# Altium schematic sheet POEInjectorTop.SchDoc
size A
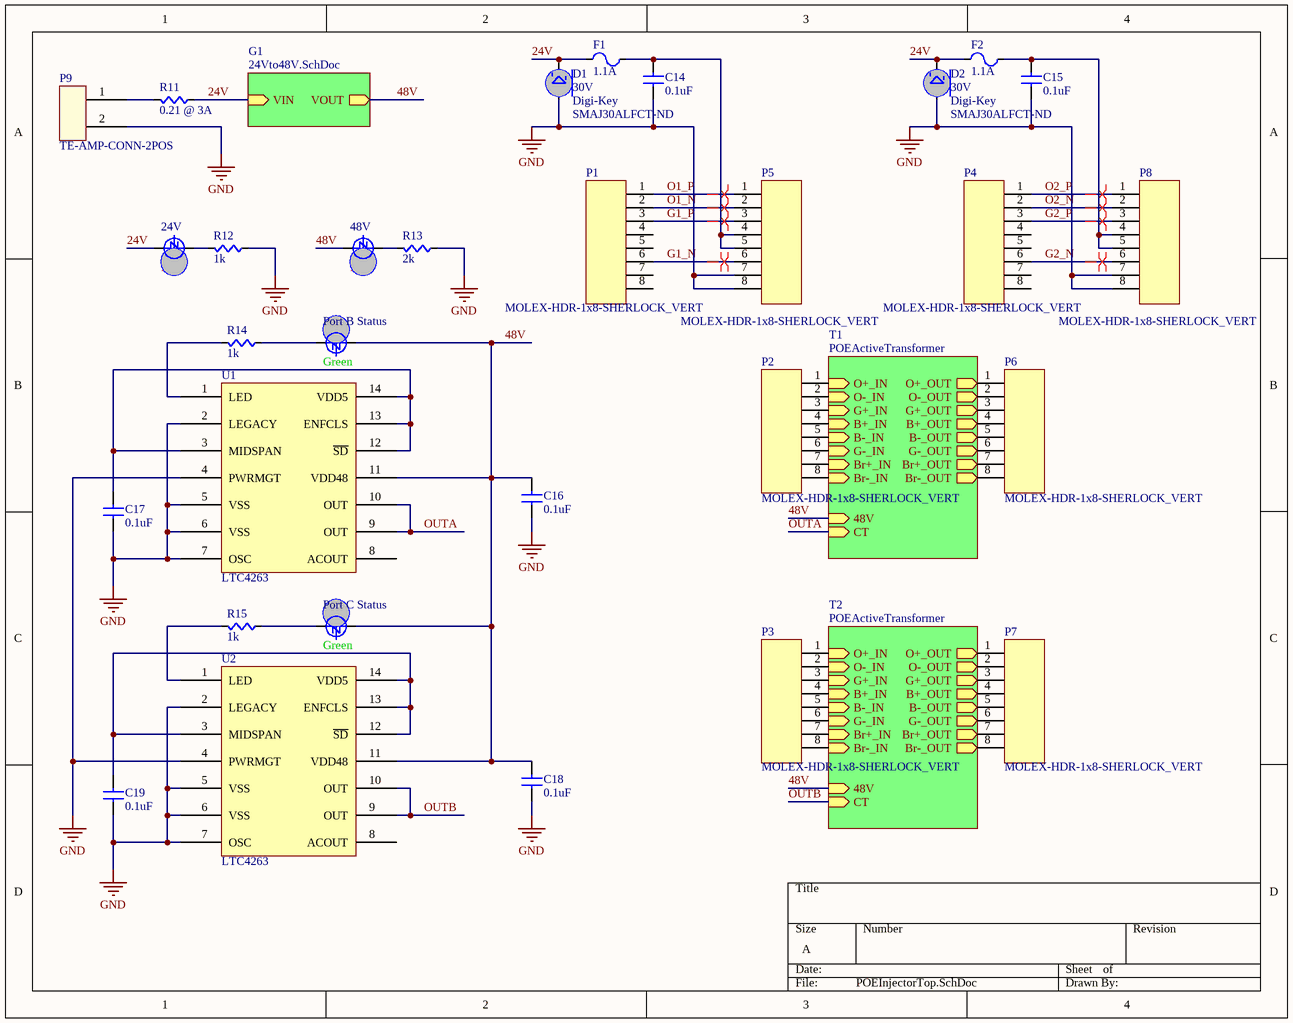
[diagram p0: POEInjectorTop.SchDoc]

## Parts
24V  Color: Red  [LED0603]  (hidden comment: LED)
48V  Color: Red  [LED0603]  (hidden comment: LED)
C14  value 0.1uF  [CAPC0603]  (hidden comment: Cap)
C15  value 0.1uF  [CAPC0603]  (hidden comment: Cap)
C16  value 0.1uF  [CAPC0603]  (hidden comment: Cap)
C17  value 0.1uF  [CAPC0603]  (hidden comment: Cap)
C18  value 0.1uF  [CAPC0603]  (hidden comment: Cap)
C19  value 0.1uF  [CAPC0603]  (hidden comment: Cap)
D1  value 30V  Supplier 1: Digi-Key  Supplier Part Number 1: SMAJ30ALFCT-ND  [SMASeries]  (hidden comment: Zener)
D2  value 30V  Supplier 1: Digi-Key  Supplier Part Number 1: SMAJ30ALFCT-ND  [SMASeries]  (hidden comment: Zener)
F1  value 1.1A  [PTC7451X11N]  (hidden comment: PTC Fuse)
F2  value 1.1A  [PTC7451X11N]  (hidden comment: PTC Fuse)
P1  MOLEX-HDR-1x8-SHERLOCK_VERT  [MOLEX-HDR-1X8-SHERLOCK-VERT]
P2  MOLEX-HDR-1x8-SHERLOCK_VERT  [MOLEX-HDR-1X8-SHERLOCK-VERT]
P3  MOLEX-HDR-1x8-SHERLOCK_VERT  [MOLEX-HDR-1X8-SHERLOCK-VERT]
P4  MOLEX-HDR-1x8-SHERLOCK_VERT  [MOLEX-HDR-1X8-SHERLOCK-VERT]
P5  MOLEX-HDR-1x8-SHERLOCK_VERT  [MOLEX-HDR-1X8-SHERLOCK-VERT]
P6  MOLEX-HDR-1x8-SHERLOCK_VERT  [MOLEX-HDR-1X8-SHERLOCK-VERT]
P7  MOLEX-HDR-1x8-SHERLOCK_VERT  [MOLEX-HDR-1X8-SHERLOCK-VERT]
P8  MOLEX-HDR-1x8-SHERLOCK_VERT  [MOLEX-HDR-1X8-SHERLOCK-VERT]
P9  TE-AMP-CONN-2POS  [TE AMP CONN 2POS]
Port_B_Status  Color: Green  [LED0603]  (hidden comment: LED)
Port_C_Status  Color: Green  [LED0603]  (hidden comment: LED)
R11  value 0.21 @ 3A  [AXIAL-0.3]  (hidden comment: Res)
R12  value 1k  [RES0603]  (hidden comment: Res)
R13  value 2k  [RES0603]  (hidden comment: Res)
R14  value 1k  [RES0603]  (hidden comment: Res)
R15  value 1k  [RES0603]  (hidden comment: Res)
U1  LTC4263  [LTC4263]
U2  LTC4263  [LTC4263]

## Sub-sheets
G1 = 24Vto48V.SchDoc: VIN (in), VOUT (out)
T1 = POEActiveTransformer: O+_IN, O-_IN, G+_IN, B+_IN, B-_IN, G-_IN, Br+_IN, Br-_IN, O+_OUT, O-_OUT, G+_OUT, B+_OUT, B-_OUT, G-_OUT, Br+_OUT, Br-_OUT, 48V, CT
T2 = POEActiveTransformer: O+_IN, O-_IN, G+_IN, B+_IN, B-_IN, G-_IN, Br+_IN, Br-_IN, O+_OUT, O-_OUT, G+_OUT, B+_OUT, B-_OUT, G-_OUT, Br+_OUT, Br-_OUT, 48V, CT

## Nets
GND: C14.2(B) C15.2(B) C16.2(B) C17.2(B) C18.2(B) C19.2(B) D1.A D2.A P5.7 P5.8 P8.7 P8.8 P9.2 R12.2(B) R13.2(B) U1.2(LEGACY) U1.4(PWRMGT) U1.5(VSS) U1.6(VSS) U1.7(OSC) U2.2(LEGACY) U2.4(PWRMGT) U2.5(VSS) U2.6(VSS) U2.7(OSC)
24V: 24V.A D1.C D2.C F1.1(A) F2.1(A) R11.2(B) ; sheet G1/VIN
48V: 48V.A C16.1(A) C18.1(A) Port_B_Status.A Port_C_Status.A U1.11(VDD48) U2.11(VDD48) ; sheet G1/VOUT, sheet T1/48V, sheet T2/48V
G1_N: P1.6 P5.6
G1_P: P1.3 P5.3
G2_N: P4.6 P8.6
G2_P: P4.3 P8.3
O1_N: P1.2 P5.2
O1_P: P1.1 P5.1
O2_N: P4.2 P8.2
O2_P: P4.1 P8.1
OUTA: U1.9(OUT) U1.10(OUT) ; sheet T1/CT
OUTB: U2.9(OUT) U2.10(OUT) ; sheet T2/CT
Net24V_C: 24V.C R12.1(A)
Net48V_C: 48V.C R13.1(A)
NetC14_1: C14.1(A) F1.2(B) P5.4 P5.5
NetC15_1: C15.1(A) F2.2(B) P8.4 P8.5
NetC17_1: C17.1(A) U1.3(MIDSPAN) U1.12(~{SD}) U1.13(ENFCLS) U1.14(VDD5)
NetC19_1: C19.1(A) U2.3(MIDSPAN) U2.12(~{SD}) U2.13(ENFCLS) U2.14(VDD5)
NetP2_1: P2.1 ; sheet T1/O+_IN
NetP2_2: P2.2 ; sheet T1/O-_IN
NetP2_3: P2.3 ; sheet T1/G+_IN
NetP2_4: P2.4 ; sheet T1/B+_IN
NetP2_5: P2.5 ; sheet T1/B-_IN
NetP2_6: P2.6 ; sheet T1/G-_IN
NetP2_7: P2.7 ; sheet T1/Br+_IN
NetP2_8: P2.8 ; sheet T1/Br-_IN
NetP3_1: P3.1 ; sheet T2/O+_IN
NetP3_2: P3.2 ; sheet T2/O-_IN
NetP3_3: P3.3 ; sheet T2/G+_IN
NetP3_4: P3.4 ; sheet T2/B+_IN
NetP3_5: P3.5 ; sheet T2/B-_IN
NetP3_6: P3.6 ; sheet T2/G-_IN
NetP3_7: P3.7 ; sheet T2/Br+_IN
NetP3_8: P3.8 ; sheet T2/Br-_IN
NetP6_1: P6.1 ; sheet T1/O+_OUT
NetP6_2: P6.2 ; sheet T1/O-_OUT
NetP6_3: P6.3 ; sheet T1/G+_OUT
NetP6_4: P6.4 ; sheet T1/B+_OUT
NetP6_5: P6.5 ; sheet T1/B-_OUT
NetP6_6: P6.6 ; sheet T1/G-_OUT
NetP6_7: P6.7 ; sheet T1/Br+_OUT
NetP6_8: P6.8 ; sheet T1/Br-_OUT
NetP7_1: P7.1 ; sheet T2/O+_OUT
NetP7_2: P7.2 ; sheet T2/O-_OUT
NetP7_3: P7.3 ; sheet T2/G+_OUT
NetP7_4: P7.4 ; sheet T2/B+_OUT
NetP7_5: P7.5 ; sheet T2/B-_OUT
NetP7_6: P7.6 ; sheet T2/G-_OUT
NetP7_7: P7.7 ; sheet T2/Br+_OUT
NetP7_8: P7.8 ; sheet T2/Br-_OUT
NetP9_1: P9.1 R11.1(A)
NetPort_B_Status_C: Port_B_Status.C R14.2(B)
NetPort_C_Status_C: Port_C_Status.C R15.2(B)
NetR14_1: R14.1(A) U1.1(LED)
NetR15_1: R15.1(A) U2.1(LED)

Not connected (* = marked no-connect by the designer): P1 4 5 7 8; P4 4 5 7 8; U1 8(ACOUT); U2 8(ACOUT)

## Layout directives
differential pair: G1_N, G1_P, G2_N, G2_P, O1_N, O1_P, O2_N, O2_P

## Library data of the parts
D1 D2 = Zener: Zener Diode
F1 F2 = PTC_Fuse: Supplier 1: Digi-Key; Supplier Part Number 1: 507-1744-1-ND
P1-P8 = MOLEX-HDR-1x8-SHERLOCK_VERT: CONN HEADER 8POS 2MM VERT TIN; Supplier 1: Digi-Key; Supplier Part Number 1: WM18926-ND
P9 = TE-AMP-CONN-2POS: 2 Positions Header Connector 0.156" (3.96mm) Through Hole Tin; Supplier 1: Digi-Key; Supplier Part Number 1: A99845-ND; Mating Conn. Digi-Key P/N: A103948-ND
U1 U2 = LTC4263: IC POE 803.2AF SINGL PSE 14-SOIC; Supplier 1: Digi-Key; Supplier Part Number 1: LTC4263CS#PBF-ND
24V 48V Port_B_Status Port_C_Status = LED: Supplier 1: Digi-Key
  24V 48V: Supplier Part Number 1: 754-1122-1-ND
  Port_B_Status Port_C_Status: Supplier Part Number 1: 754-1121-1-ND
C14-C19 = Cap: Supplier 1: Digi-Key
  C14-C16 C18: Supplier Part Number 1: 1276-6807-1-ND
  C17 C19: Supplier Part Number 1: 1276-1000-1-ND
R11-R15 = Res: Supplier 1: Digi-Key
  R11: Supplier Part Number 1: 311-10.0HRCT-ND
  R12 R14 R15: Supplier Part Number 1: RMCF0603JJ1K00CT-ND
  R13: Supplier Part Number 1: RMCF0603JT2K00CT-ND